# Altium project buck-converter-altium.PrjPcb
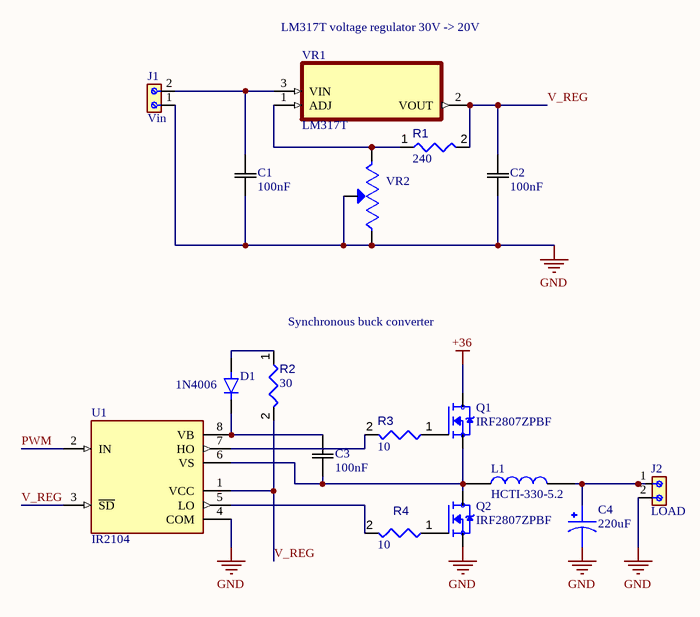
[diagram p0: buck-converter-altium.SchDoc]
1 sheet, 17 parts. Net scope: global (net labels, ports and power ports of the same name join across sheets).
Board file: buck-converter-altium.PcbDoc

## Sheet buck-converter-altium.SchDoc
size A4; SheetNumber: 1; SheetTotal: 1

### Parts
C1  100nF  [CAP_R82E-7P4X2P6-5P0_KEM]
C2  100nF  [CAP_R82E-7P4X2P6-5P0_KEM]
C3  100nF  [CAP_R82E-7P4X2P6-5P0_KEM]
C4  220uF  [CAPPRD500W60D1000H1350]
D1  1N4006  [DIOAD1036W78L470D235]
J1  Vin  [691103110002]
J2  LOAD  [691103110002]
L1  HCTI-330-5.2  [IND_HCTI-220-5.8]
Q1  IRF2807ZPBF  [TO254P1016X419X2057-3]
Q2  IRF2807ZPBF  [TO254P1016X419X2057-3]
R1  value 240  [RESA60-630X240]  (hidden comment: 4k7 resistor Axial)
R2  value 30  [RESA60-630X240]  (hidden comment: 4k7 resistor Axial)
R3  value 10  [RESA60-630X240]  (hidden comment: 4k7 resistor Axial)
R4  value 10  [RESA60-630X240]  (hidden comment: 4k7 resistor Axial)
U1  IR2104  [DIP762W45P254L988H533Q8]
VR1  LM317T  [TO254P1054X470X1955-3]
VR2  (no value)  [TRIM_3296W-1-202RLF]

### Nets
+36: Q1.2(D)
GND: C1.2 C2.2 C4.2 J1.1 J2.2 Q2.3(S) U1.4(COM) VR2.1(CCW) VR2.2(WIPER)
PWM: U1.2(IN)
V_REG: C2.1 R1.2 R2.2 U1.1(VCC) U1.3(~{SD}) VR1.2(VOUT)
NetC1_1: C1.1 J1.2 VR1.3(VIN)
NetC3_1: C3.1 D1.C(K) U1.8(VB)
NetC3_2: C3.2 L1.1 Q1.3(S) Q2.2(D) U1.6(VS)
NetC4_1: C4.1 J2.1 L1.2
NetD1_A: D1.A R2.1
NetQ1_1: Q1.1(G) R3.1
NetQ2_1: Q2.1(G) R4.1
NetR1_1: R1.1 VR1.1(ADJ) VR2.3(CW)
NetR3_2: R3.2 U1.7(HO)
NetR4_2: R4.2 U1.5(LO)

### Notes on the sheet
- LM317T voltage regulator 30V -> 20V
- (near R2) Synchronous buck converter

### Library data of the parts
C1-C3 = R82EC3100Z370J: R82, Film, Metallized Polyester Stacked, Automotive Grade, 0.1 uF, 5%, 100 VDC, 85Ã‚Â°C, Lead Spacing = 5mm; Manufacturer_Name: Kemet; Type: Film Capacitor; Copyright: Copyright (C) 2026 Ultra Librarian. All rights reserved.; Manufacturer_Part_Number: R82EC3100Z370J; Datasheet: https://content.kemet.com/datasheets/KEM_F3101_R82.pdf
C4 = B41866C7227M000: 220 ÂµF 35 V Aluminum Electrolytic Capacitors Radial, Can 373mOhm @ 100kHz 3000 Hrs @ 125Â°C; MF: EPCOS - TDK Electronics; SnapEDA_Link: https://www.snapeda.com/parts/B41866C7227M000/EPCOS/view-part/?ref=snap; Package: None; Value: *; MP: B41866C7227M000; Check_prices: https://www.snapeda.com/parts/B41866C7227M000/EPCOS/view-part/?ref=eda
D1 = 1N4006GH: 1A, 800V, Standard Rectifier; MF: Taiwan Semiconductor; SnapEDA_Link: https://www.snapeda.com/parts/1N4006GH/taiwan/view-part/?ref=snap; Package: DO-41-2 Taiwan Semiconductor; Value: *; MP: 1N4006GH; Check_prices: https://www.snapeda.com/parts/1N4006GH/taiwan/view-part/?ref=eda
J1 J2 = 691103110002: MF: {'manufacturer': u'Wurth Electronics'}; Package: None; Price: None; Value: *; MP: 691103110002; Availability: Unavailable
L1 = HCTI-330-5.2: High Current Toroidal Inductor | 330 uH; MF: Signal Transformer; SnapEDA_Link: https://www.snapeda.com/parts/HCTI-330-5.2/Signal+Transformer/view-part/?ref=snap; Package: Radial Bel Fuse; Value: *; MP: HCTI-330-5.2; Check_prices: https://www.snapeda.com/parts/HCTI-330-5.2/Signal+Transformer/view-part/?ref=eda
Q1 Q2 = IRF2807ZPBF: MOSFET, Power,N-Ch,VDSS 75V,RDS(ON) 7.5 Milliohms,ID 89A,TO-220AB,PD 170W,-55C | Infineon IRF2807ZPBF; SnapEDA_Link: https://www.snapeda.com/parts/IRF2807ZPBF/Infineon/view-part/?ref=snap; Package: TO-220-3 Infineon; Value: *; MF: Infineon; MP: IRF2807ZPBF; Check_prices: https://www.snapeda.com/parts/IRF2807ZPBF/Infineon/view-part/?ref=eda
R1-R4 = CMP-009-00178-1: Axial Resistor, 4.7 KOhm; Tolerance: 1%; Package Description: 2-Pin Axial Lead, Dia 2.4 mm, Body Length 6.3 mm; Component Type: Resistors
U1 = IR2104: Half-Bridge Gate Driver IC Non-Inverting 8-PDIP; MF: Infineon Technologies; SnapEDA_Link: https://www.snapeda.com/parts/IR2104/Infineon/view-part/?ref=snap; Package: DIP-8 Infineon; Value: *; MP: IR2104; Check_prices: https://www.snapeda.com/parts/IR2104/Infineon/view-part/?ref=eda
VR1 = LM317T: Linear Voltage Regulator IC Positive Adjustable 1 Output 1.5A TO-220AB; MF: onsemi; SnapEDA_Link: https://www.snapeda.com/parts/LM317T/Onsemi/view-part/?ref=snap; Package: TO-220-3 ON; Value: *; MP: LM317T; Check_prices: https://www.snapeda.com/parts/LM317T/Onsemi/view-part/?ref=eda
VR2 = 3296W-1-202RLF: TRIMMER - 3/8in SQ MT CERMET | Bourns 3296W-1-202RLF; SnapEDA_Link: https://www.snapeda.com/parts/3296W-1-202RLF/Bourns/view-part/?ref=snap; Package: NON STANDARD-3 Bourns; Value: *; MF: Bourns; MP: 3296W-1-202RLF; Check_prices: https://www.snapeda.com/parts/3296W-1-202RLF/Bourns/view-part/?ref=eda